# EAGLE design th12 (EAGLE 5.12)

## Sheet 1 of 2
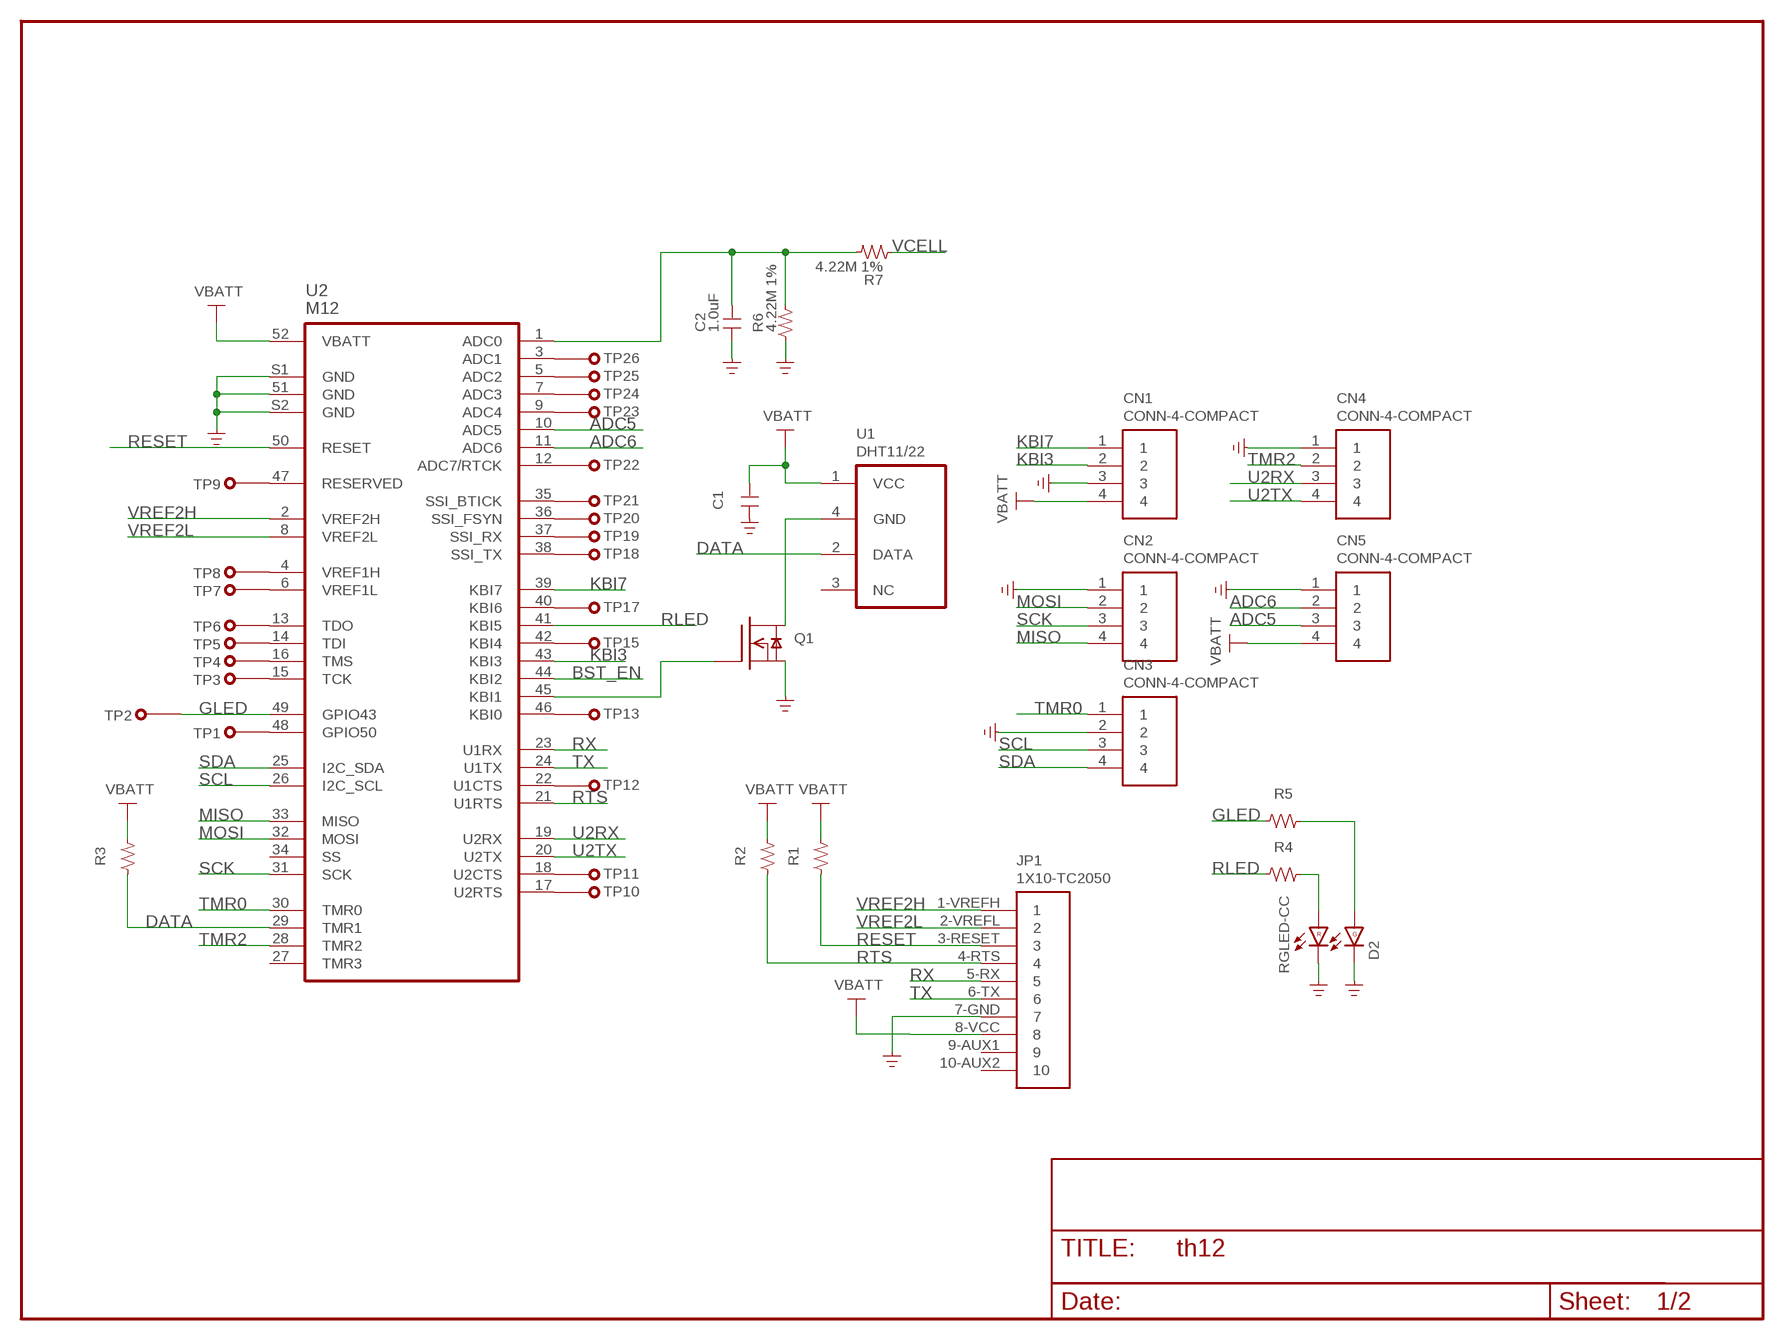
[diagram p0: schematic, sheet 1]

### Parts
C1  C-0603  [SMD0603]
C2  1.0uF  C-0603  [SMD0603]
CN1  CONN-4-COMPACT  [1X4-3.5MM-COMPACT]
CN2  CONN-4-COMPACT  [1X4-3.5MM-COMPACT]
CN3  CONN-4-COMPACT  [1X4-3.5MM-COMPACT]
CN4  CONN-4-COMPACT  [1X4-3.5MM-COMPACT]
CN5  CONN-4-COMPACT  [1X4-3.5MM-COMPACT]
D2  RGLED-CC  [598-8520-207F]
JP1  1X10-TC2050  [TC2050-IDC]
Q1  NFET  [SOT23-GSD]
R1  R-0603  [SMD0603]
R2  R-0603  [SMD0603]
R3  R-0603  [SMD0603]
R4  R-0603  [SMD0603]
R5  R-0603  [SMD0603]
R6  4.22M 1%  R-0603  [SMD0603]
R7  4.22M 1%  R-0603  [SMD0603]
TP1  TP  [15MIL]
TP2  TP  [15MIL]
TP3  TP  [15MIL]
TP4  TP  [15MIL]
TP5  TP  [15MIL]
TP6  TP  [15MIL]
TP7  TP  [15MIL]
TP8  TP  [15MIL]
TP9  TP  [15MIL]
TP10  TP  [15MIL]
TP11  TP  [15MIL]
TP12  TP  [15MIL]
TP13  TP  [15MIL]
TP15  TP  [15MIL]
TP17  TP  [15MIL]
TP18  TP  [15MIL]
TP19  TP  [15MIL]
TP20  TP  [15MIL]
TP21  TP  [15MIL]
TP22  TP  [15MIL]
TP23  TP  [15MIL]
TP24  TP  [15MIL]
TP25  TP  [15MIL]
TP26  TP  [15MIL]
U1  DHT11/22  [DHT22]
U2  M12  [M12]

### Nets
ADC5: CN5.3 U2.10(ADC5)
ADC6: CN5.2 U2.11(ADC6)
BST_EN: U2.44(KBI2) ; also sheet 2
DATA: R3.1 U1.2(DATA) U2.29(TMR1)
GLED: R5.1 TP2.1 U2.49(GPIO43)
GND: C1.1 C2.1 CN1.3 CN2.1 CN3.2 CN4.1 CN5.1 D2.2 D2.4 JP1.7-GND Q1.S R6.1 U2.51(GND) U2.S1(GND) U2.S2(GND) ; also sheet 2
KBI3: CN1.2 U2.43(KBI3)
KBI7: CN1.1 U2.39(KBI7)
MISO: CN2.4 U2.33(MISO)
MOSI: CN2.2 U2.32(MOSI)
N$1: Q1.D U1.4(GND)
N$2: Q1.G U2.45(KBI1)
N$3: TP1.1 U2.48(GPIO50)
N$5: TP3.1 U2.15(TCK)
N$6: TP4.1 U2.16(TMS)
N$7: TP5.1 U2.14(TDI)
N$8: TP6.1 U2.13(TDO)
N$9: TP7.1 U2.6(VREF1L)
N$10: TP8.1 U2.4(VREF1H)
N$11: TP9.1 U2.47(RESERVED)
N$12: TP10.1 U2.17(U2RTS)
N$13: TP11.1 U2.18(U2CTS)
N$14: TP12.1 U2.22(U1CTS)
N$15: TP13.1 U2.46(KBI0)
N$16: C2.2 R6.2 R7.2 U2.1(ADC0)
N$17: TP15.1 U2.42(KBI4)
N$19: TP17.1 U2.40(KBI6)
N$20: TP18.1 U2.38(SSI_TX)
N$21: TP19.1 U2.37(SSI_RX)
N$22: TP20.1 U2.36(SSI_FSYN)
N$23: TP21.1 U2.35(SSI_BTICK)
N$24: TP22.1 U2.12(ADC7/RTCK)
N$25: TP23.1 U2.9(ADC4)
N$26: TP24.1 U2.7(ADC3)
N$27: TP25.1 U2.5(ADC2)
N$28: TP26.1 U2.3(ADC1)
N$30: D2.1 R5.2
N$31: D2.3 R4.2
RESET: JP1.3-RESET R1.1 U2.50(RESET)
RLED: R4.1 U2.41(KBI5)
RTS: JP1.4-RTS R2.1 U2.21(U1RTS)
RX: JP1.5-RX U2.23(U1RX)
SCK: CN2.3 U2.31(SCK)
SCL: CN3.3 U2.26(I2C_SCL)
SDA: CN3.4 U2.25(I2C_SDA)
TMR0: CN3.1 U2.30(TMR0)
TMR2: CN4.2 U2.28(TMR2)
TX: JP1.6-TX U2.24(U1TX)
U2RX: CN4.3 U2.19(U2RX)
U2TX: CN4.4 U2.20(U2TX)
VBATT: C1.2 CN1.4 CN5.4 JP1.8-VCC R1.2 R2.2 R3.2 U1.1(VCC) U2.52(VBATT) ; also sheet 2
VCELL: R7.1 ; also sheet 2
VREF2H: JP1.1-VREFH U2.2(VREF2H)
VREF2L: JP1.2-VREFL U2.8(VREF2L)
Unconnected: JP1.9-AUX1 JP1.10-AUX2 U1.3(NC) U2.27(TMR3) U2.34(SS)

## Sheet 2 of 2
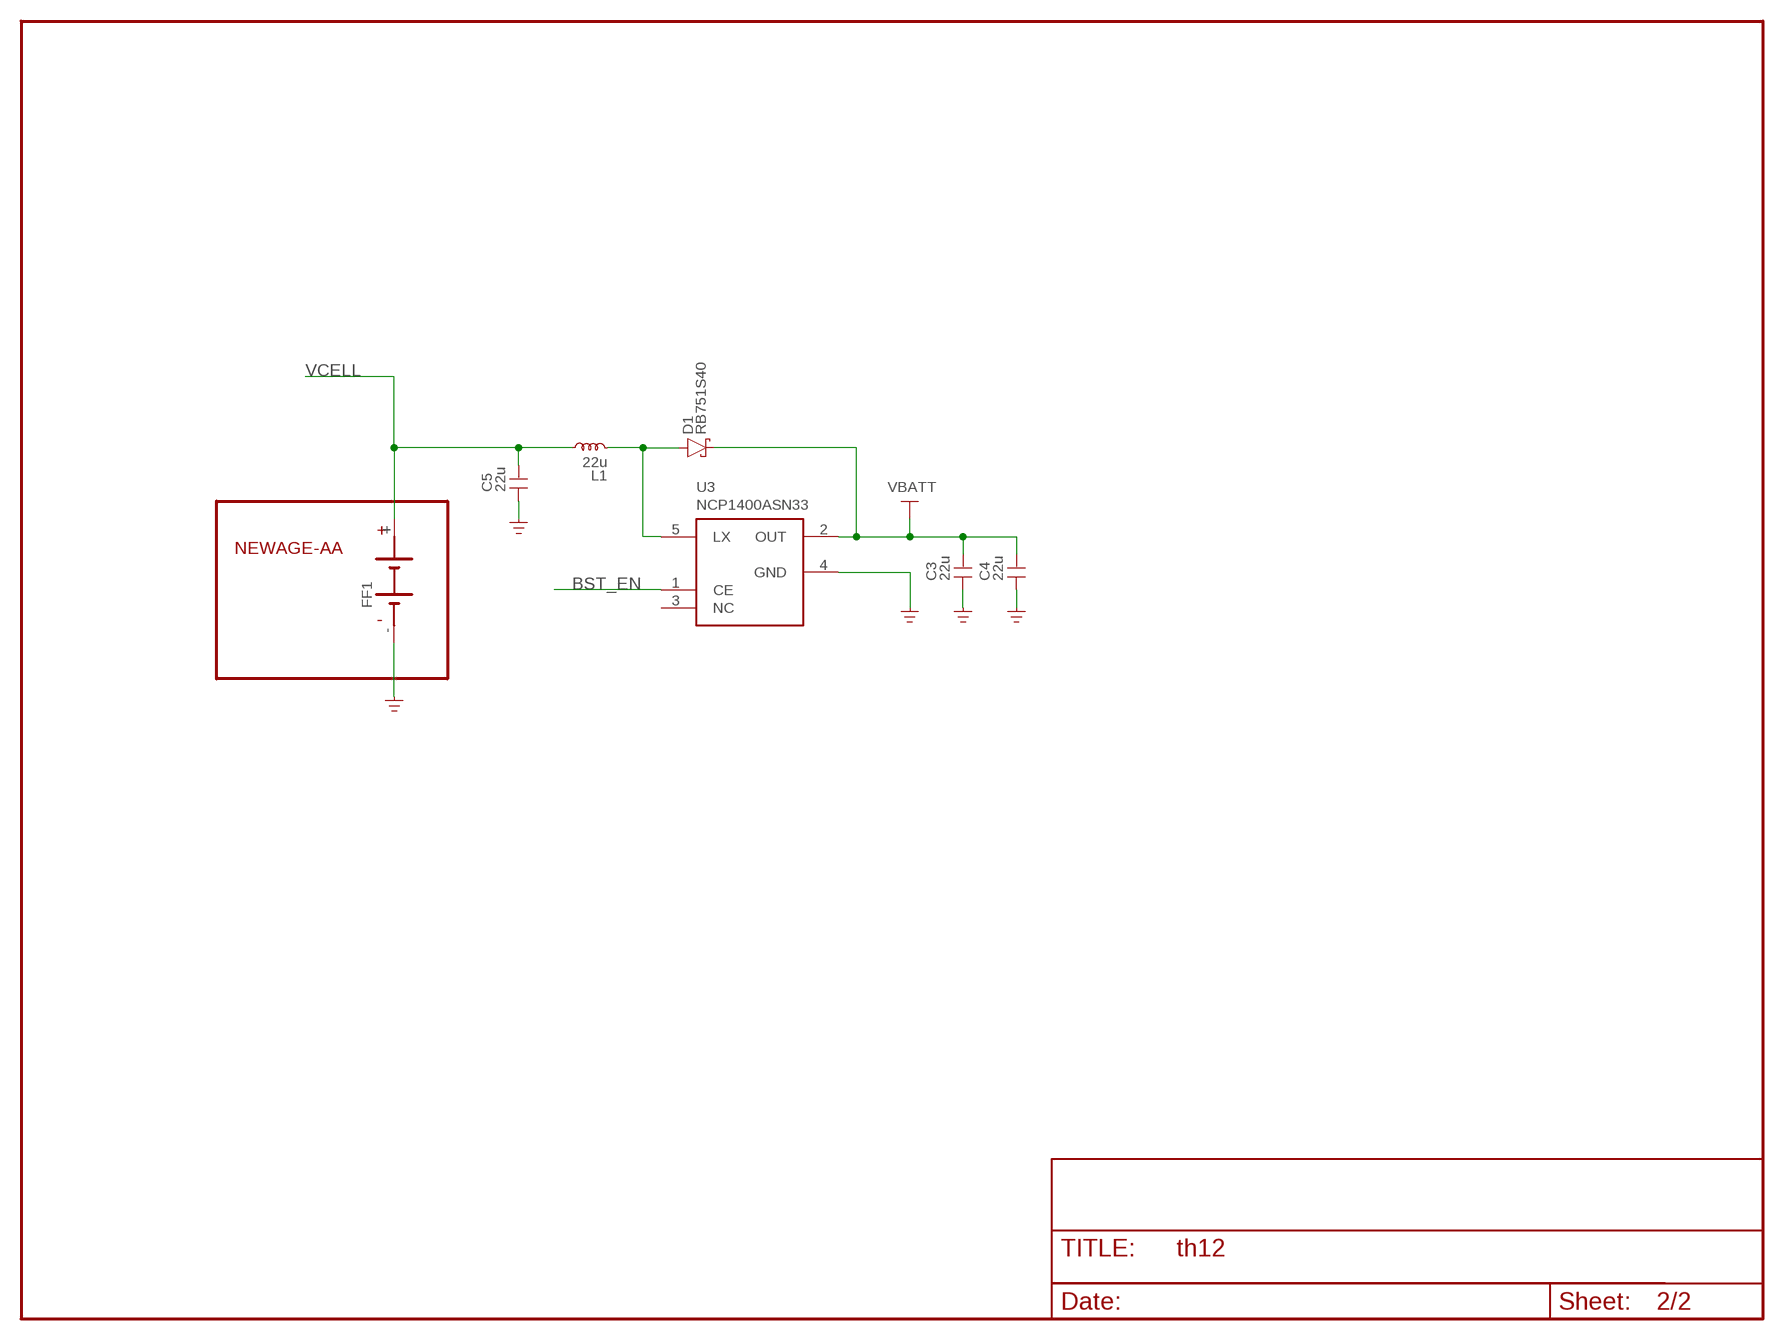
[diagram p1: schematic, sheet 2]

### Parts
C3  22u  C-0805  [SMD0805]
C4  22u  C-0805  [SMD0805]
C5  22u  C-0805  [SMD0805]
D1  RB751S40  D-SCHOTTKY-SOD523  [SOD-523]
FF1  NEWAGE-AA  [NEWAGE-AA-SIMPLE]
L1  22u  L-2518  [SMD2518]
U3  NCP1400ASN33  [SOT-23-5]

### Nets
BST_EN: U3.1(CE) ; also sheet 1
GND: C3.1 C4.1 C5.1 FF1.-(-1) U3.4(GND) ; also sheet 1
N$4: D1.A L1.2 U3.5(LX)
VBATT: C3.2 C4.2 D1.K(C) U3.2(OUT) ; also sheet 1
VCELL: C5.2 FF1.+(+1) L1.1 ; also sheet 1
Unconnected: U3.3(NC)

## Library data of the parts
C1-C5 = parts:C
CN1-CN5 = parts:CONN-4
D1 = parts:D-SCHOTTKY
D2 = parts:RGLED-CC
FF1 = parts:NEWAGE-AA
JP1 = parts:1X10
L1 = parts:L: TDK SLF6028 Series From mouser: 810-SLF6028T-101M, 100uH, .42A, $2.73 From digikey: 445-1990-1-ND, 100uH, .42A, $2.73
Q1 = parts:NFET
R1-R7 = parts:R
TP1-TP13 TP15 TP17-TP26 = parts:TP
U1 = parts:DHT11/22
U2 = parts:M12
U3 = parts:NCP1400ASN*

## Board
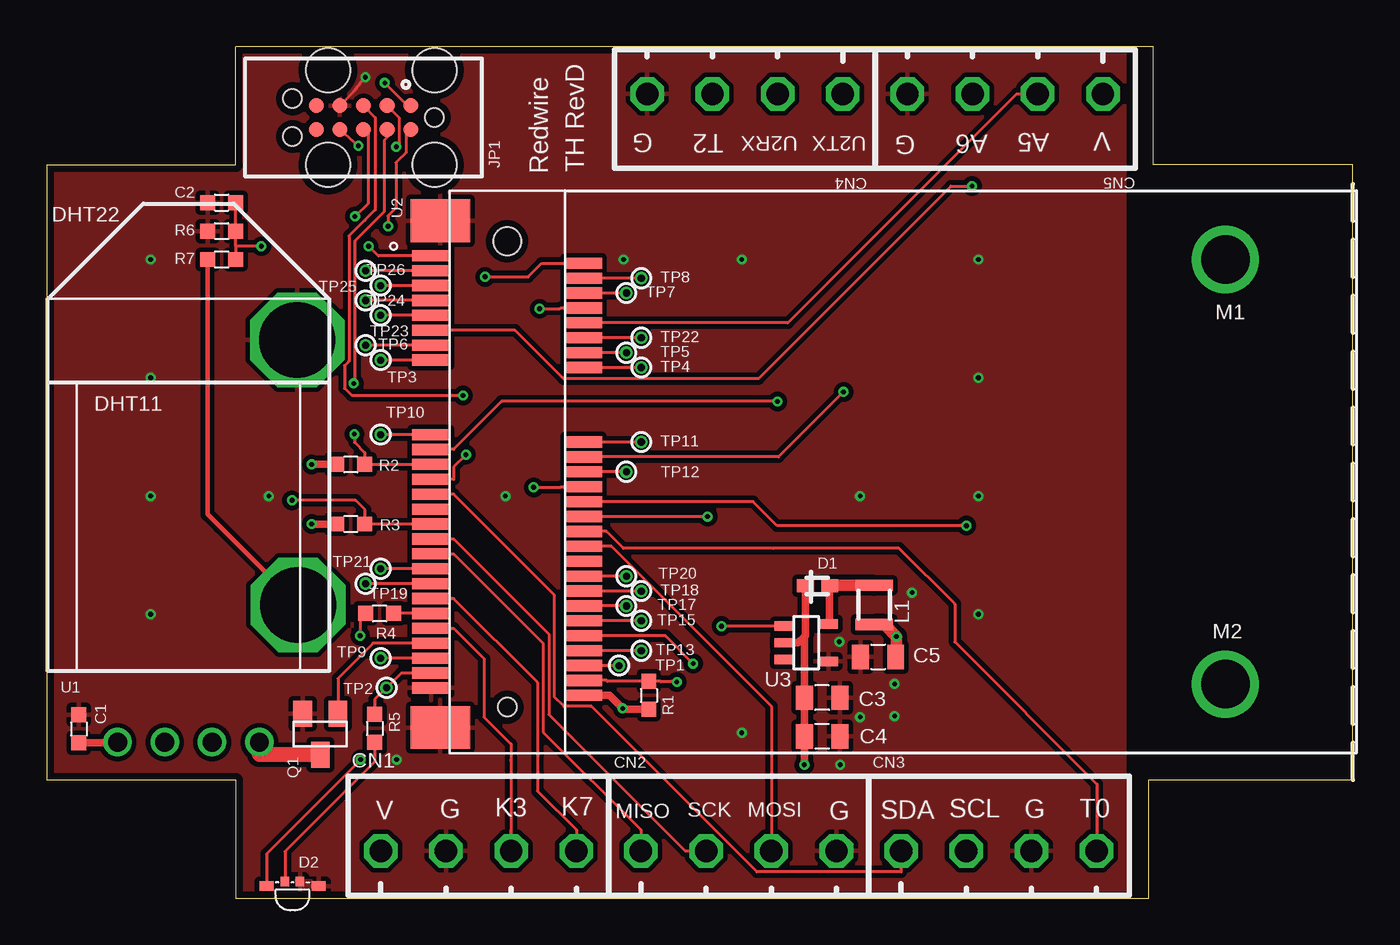
[diagram p2: board, top side]
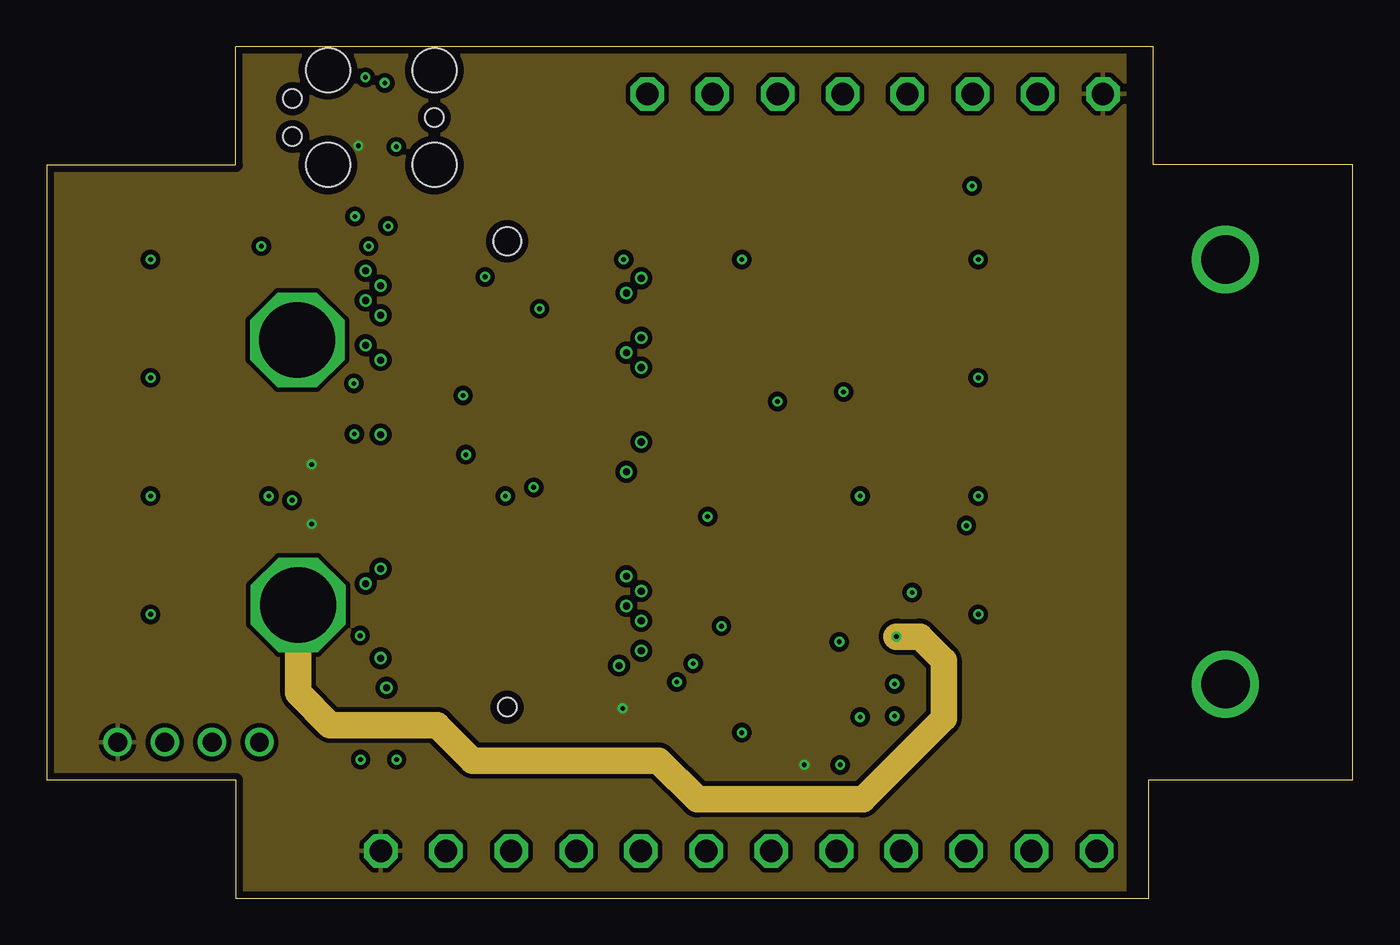
[diagram p3: board, inner layer Route2]
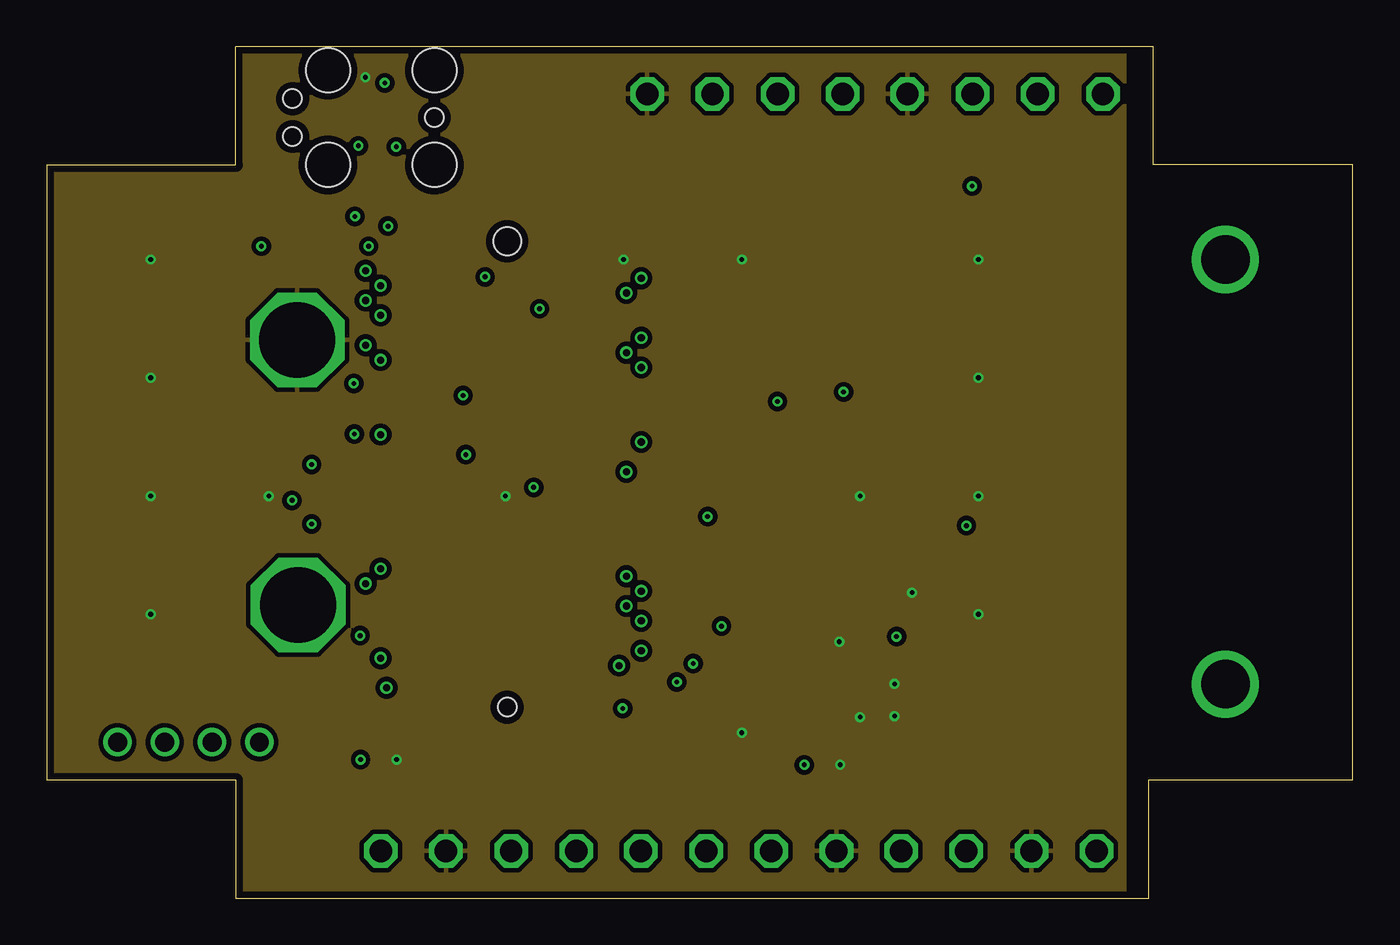
[diagram p4: board, inner layer Route3]
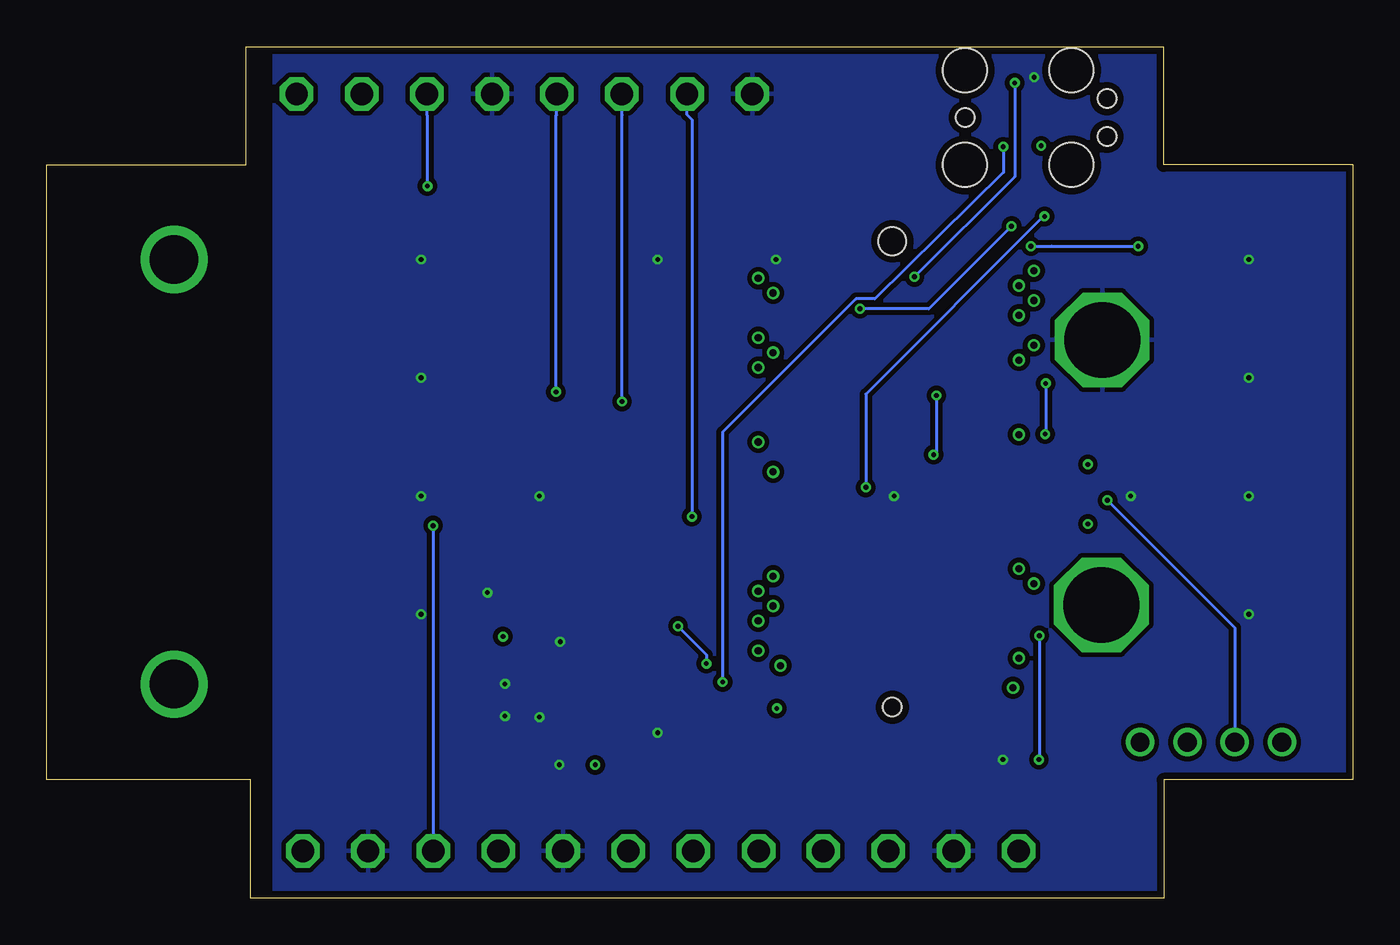
[diagram p5: board, bottom side, seen from below]

Size 70.15 x 45.72 mm. Coordinates in mm from the lower left corner, seen from the top.
Copper layers (1+2*3+16): Top 0.0356mm / dielectric 0.2794mm / Route2 0.0356mm / dielectric 0.9906mm / Route3 0.0356mm / dielectric 0.2794mm / Bottom 0.0356mm
Design rules "66each-compact *": minimum track width 6mil, minimum drill 10mil, track to track 6mil, track to pad 6mil, pad to pad 6mil, via to via 6mil, smd to smd 6mil, copper to edge 15mil, drill to drill 10mil, minimum pad ring 5.5mil, minimum via ring 5.5mil, stop-mask expansion 2.5mil, vias tented up to drill 15mil, thermal gap 10mil

### Footprints (pad centres in the part's own frame; a part is rotated, then mirrored left to right if it is on the bottom)
SMD0603 = smd 0.8 x 0.8: 1 -0.75,0; 2 0.75,0
SMD0805 = smd 0.9 x 1.3: 1 -0.95,0; 2 0.95,0
1X4-3.5MM-COMPACT = drill 1.2 octagon: 1 0,0; 2 0,-3.5; 3 0,-7; 4 0,-10.5
SOD-523 = smd 0.9 x 0.7: A -0.65,0; K 0.65,0
598-8520-207F = smd 0.5 x 0.5: 1 0.4,-0.55; 2 -0.4,-0.55 | smd 0.8 x 0.5: 3 1.4,-0.3; 4 -1.4,-0.3
NEWAGE-AA-SIMPLE = drill 4.064 octagon: + -21.285,-7.112; - -21.336,7.112
TC2050-IDC = smd 0.8 x 0.8: 1-VREFH -2.54,-0.635; 2-VREFL -2.54,0.635; 3-RESET -1.27,-0.635; 4-RTS -1.27,0.635; 5-RX 0,-0.635; 6-TX 0,0.635; 7-GND 1.27,-0.635; 8-VCC 1.27,0.635; 9-AUX1 2.54,-0.635; 10-AUX2 2.54,0.635 | hole 1: -3.81,0; 3.81,1.016; 3.81,-1.016 | hole 2.375: -3.81,2.54; -3.81,-2.54; 1.905,2.54; 1.905,-2.54
SMD2518 = smd 0.6 x 2: 1 -1.05,0; 2 1.05,0
SOT23-GSD = smd 1 x 1.4: D 0,1.1; G -0.95,-1.1; S 0.95,-1.1
15MIL = drill 0.381 round: 1 0,0
DHT22 = drill 1.016 round: 1 -3.81,-3.81; 2 -1.27,-3.81; 3 1.27,-3.81; 4 3.81,-3.81
M12 = smd 0.6 x 2: 1 -11.6,-4.1; 2 -11.2,4.1; 3 -10.8,-4.1; 4 -10.4,4.1; 5 -10,-4.1; 6 -9.6,4.1; 7 -9.2,-4.1; 8 -8.8,4.1; 9 -8.4,-4.1; 10 -8,4.1; 11 -7.6,-4.1; 12 -7.2,4.1; 13 -6.8,-4.1; 14 -6.4,4.1; 15 -6,-4.1; 16 -5.6,4.1; 17 -2,-4.1; 18 -1.6,4.1; 19 -1.2,-4.1; 20 -0.8,4.1; 21 -0.4,-4.1; 22 0,4.1; 23 0.4,-4.1; 24 0.8,4.1; 25 1.2,-4.1; 26 1.6,4.1; 27 2,-4.1; 28 2.4,4.1; 29 2.8,-4.1; 30 3.2,4.1; 31 3.6,-4.1; 32 4,4.1; 33 4.4,-4.1; 34 4.8,4.1; 35 5.2,-4.1; 36 5.6,4.1; 37 6,-4.1; 38 6.4,4.1; 39 6.8,-4.1; 40 7.2,4.1; 41 7.6,-4.1; 42 8,4.1; 43 8.4,-4.1; 44 8.8,4.1; 45 9.2,-4.1; 46 9.6,4.1; 47 10,-4.1; 48 10.4,4.1; 49 10.8,-4.1; 50 11.2,4.1; 51 11.6,-4.1; 52 12,4.1 | drill 2.6 round: 53 -11.4,38.565; 54 11.4,38.565 | smd 2.3 x 3.2: S1 -13.473,-3.6; S2 13.727,-3.6 | hole 1.016: 12.627,0 | hole 1.499: -12.373,0
SOT-23-5 = smd 0.5 x 1: 1 0.9,1.3; 2 0,1.3; 3 -0.9,1.3; 4 -1,-1.1; 5 1,-1.1

### Placement (x,y rotation side)
C1  1.74,9.09 270 top
C2  9.4,37.34 0 top
C3  41.66,10.77 180 top
C4  41.66,8.69 180 top
C5  44.65,12.95 0 top
CN1  28.45,2.54 270 top
CN2  42.42,2.54 270 top
CN3  56.39,2.54 270 top
CN4  32.26,43.18 90 top
CN5  46.23,43.18 90 top
D1  41.4,16.76 180 top
D2  13.21,0.36 180 top
FF1  34.8,22.86 0 top
JP1  17.02,41.91 180 top
L1  44.45,15.75 90 top
Q1  14.7,8.81 180 top
R1  32.34,10.89 270 top
R2  16.34,23.29 180 top
R3  16.34,20.09 180 top
R4  17.88,15.29 180 top
R5  17.63,9.12 270 top
R6  9.4,35.81 0 top
R7  9.4,34.29 0 top
TP1  30.74,12.49 0 top
TP2  18.26,11.3 0 top
TP3  17.94,28.89 0 top
TP4  31.94,28.49 0 top
TP5  31.14,29.29 0 top
TP6  17.14,29.69 0 top
TP7  31.14,32.49 0 top
TP8  31.94,33.29 0 top
TP9  17.94,12.89 0 top
TP10  17.94,24.89 0 top
TP11  31.94,24.49 0 top
TP12  31.14,22.89 0 top
TP13  31.94,13.29 0 top
TP15  31.94,14.89 0 top
TP17  31.14,15.69 0 top
TP18  31.94,16.49 0 top
TP19  17.14,16.89 0 top
TP20  31.14,17.29 0 top
TP21  17.94,17.69 0 top
TP22  31.94,30.09 0 top
TP23  17.94,31.29 0 top
TP24  17.14,32.09 0 top
TP25  17.94,32.89 0 top
TP26  17.14,33.69 0 top
U1  7.62,12.19 0 top
U2  24.74,22.89 270 top
U3  40.89,13.72 90 top

### Tracks (layer width: path | path; a pad name or v marks a point on that pad's centre or on a via)
ADC5
  Top 0.152: U2.10 39.81,30.89 52.1,43.18 CN5.3
ADC6  (via drill 0.25 pad 0.51)
  Top 0.152: U2.11 25.16,30.49 27.76,27.89 38.22,27.89 48.55,38.23 v49.7,38.23
  Bottom 0.152: v49.7,38.23 49.7,42.02 49.73,42.05 CN5.2
BST_EN  (via drill 0.25)
  Top 0.152: U2.44 33.23,14.09 v34.72,12.6 | v36.25,14.6 39.58,14.6 U3.1
  Bottom 0.152: v34.72,12.6 34.72,13.08 v36.25,14.6
DATA  (via drill 0.25)
  Top 0.152: U2.29 R3.1 17.09,20.85 16.59,21.36 v13.18,21.36
  Bottom 0.152: U1.2 6.35,14.53 v13.18,21.36
GLED
  Top 0.152: U2.49 19.04,12.09 TP2.1 17.63,10.67 R5.1
GND  (via drill 0.25 pad 0.51)
  Top 0.152: JP1.7-GND 16.49,43.28 v17.12,44.07
  other vias: 50.04,21.59 50.04,27.94 50.04,15.24 43.69,21.59 50.04,34.29 5.59,21.59 5.59,15.24 5.59,27.94 5.59,34.29 11.94,21.59 24.64,21.59 30.99,34.29 37.34,34.29 37.34,8.89 18.8,7.44 42.57,13.77 43.69,9.73 42.62,7.16 45.54,11.51 45.54,9.78 46.48,16.41
  pour Top (isolate 0.254): 0,6.35 10.16,6.35 10.16,0 57.91,0 57.91,45.72 10.16,45.72 10.16,39.37 0,39.37
  pour Bottom (isolate 0.254): 0,6.35 10.16,6.35 10.16,0 57.91,0 57.91,45.72 10.16,45.72 10.16,39.37 0,39.37
  pour Route3 (isolate 0.254): 0,6.35 10.16,6.35 10.16,0 57.91,0 57.91,45.72 10.16,45.72 10.16,39.37 0,39.37
KBI3
  Top 0.152: U2.43 21.87,14.49 23.5,12.86 23.5,9.73 24.95,8.27 24.95,7.37 | 24.95,3.45 24.95,3.67 | 24.95,3.45 CN1.2 | 24.95,7.37 24.95,7.47 | 24.95,7.37 24.95,3.45
KBI7
  Top 0.152: CN1.1 28.45,3.67 26.36,5.75 26.36,11.59 21.87,16.09 U2.39
MISO
  Top 0.152: U2.33 21.87,18.49 26.67,13.69 26.67,8.92 31.92,3.67 CN2.4
MOSI
  Top 0.152: U2.32 30.34,18.89 38.92,10.31 CN2.2
N$1
  Top 0.813: Q1.D 11.43,7.71 U1.4
N$2
  Top 0.152: U2.45 17.54,13.69 15.65,11.8 Q1.G
N$3
  Top 0.152: TP1.1 U2.48
N$4
  Top 0.406: U3.5 42.05,14.77 D1.A
  Top 0.61: L1.2 42.09,16.8 D1.A
N$5
  Top 0.152: U2.15 TP3.1
N$6
  Top 0.152: TP4.1 U2.16
N$7
  Top 0.152: TP5.1 U2.14
N$8
  Top 0.152: U2.13 TP6.1
N$9
  Top 0.152: TP7.1 U2.6
N$10
  Top 0.152: TP8.1 U2.4
N$11
  Top 0.152: U2.47 TP9.1
N$12
  Top 0.152: U2.17 TP10.1
N$13
  Top 0.152: TP11.1 U2.18
N$14
  Top 0.152: TP12.1 U2.22
N$15
  Top 0.152: TP13.1 U2.46
N$16  (via drill 0.25)
  Top 0.152: U2.1 17.81,34.49 v17.3,35 | 10.15,35.03 R6.2 C2.2 | 10.15,35.03 R7.2 | v11.53,35 10.17,35 10.15,35.03
  Bottom 0.152: v17.3,35 16.18,35 v11.53,35
N$17
  Top 0.152: TP15.1 U2.42
N$19
  Top 0.152: TP17.1 U2.40
N$20
  Top 0.152: TP18.1 U2.38
N$21
  Top 0.152: U2.37 TP19.1
N$22
  Top 0.152: TP20.1 U2.36
N$23
  Top 0.152: U2.35 TP21.1
N$24
  Top 0.152: TP22.1 U2.12
N$25
  Top 0.152: U2.9 TP23.1
N$26
  Top 0.152: U2.7 TP24.1
N$27
  Top 0.152: U2.5 TP25.1
N$28
  Top 0.152: U2.3 TP26.1
N$30
  Top 0.152: R5.2 17.63,7.34 12.81,2.52 D2.1 12.65,0.94
N$31  (via drill 0.25)
  Top 0.152: R4.2 16.84,15 v16.84,14.1 | v16.87,7.44 11.81,2.38 D2.3
  Bottom 0.152: v16.84,14.1 16.84,7.44 v16.87,7.44
RESET  (via drill 0.25 pad 0.51)
  Top 0.152: U2.50 30.07,11.69 30.12,11.64 R1.1 32.97,11.64 33,11.61 v33.85,11.61 | v18.78,40.34 18.92,40.34 18.92,41.91 JP1.3-RESET
  Bottom 0.152: v33.85,11.61 33.85,25.02 26.69,32.18 25.68,32.18 18.77,38.96 18.77,40.22 18.77,40.34 v18.78,40.34
RLED
  Top 0.152: U2.41 R4.1
RTS  (via drill 0.25 pad 0.51)
  Top 0.152: v16.5,27.63 16.55,27.69 16.55,35.28 18.14,36.86 18.14,40.69 18.29,40.84 JP1.4-RTS | U2.21 R2.1 17.09,23.92 16.53,24.48 v16.53,24.92
  Bottom 0.152: v16.5,27.63 16.5,24.95 v16.53,24.92
RX  (via drill 0.25 pad 0.51)
  Top 0.152: v22.37,26.99 16.39,26.99 16,27.38 16,28.6 16.24,28.84 16.24,35.56 17.08,36.39 17.09,36.39 17.65,36.96 17.65,41.91 JP1.5-RX | v22.52,23.81 21.87,23.16 21.87,22.49 U2.23
  Bottom 0.152: v22.37,26.99 22.37,23.97 v22.52,23.81
SCK
  Top 0.152: U2.31 21.87,19.29 26.97,14.18 26.97,9.85 34.29,2.54 CN2.3
SCL  (via drill 0.25 pad 0.51)
  Top 0.152: U2.26 37.95,21.29 39.24,20 v49.4,20
  Bottom 0.152: v49.4,20 49.4,3.68 49.39,3.67 CN3.3
SDA
  Top 0.152: CN3.4 45.89,1.41 38.14,1.41 29.26,10.3 27.78,10.3 27.28,10.8 27.28,16.28 21.87,21.69 U2.25
TMR0
  Top 0.152: U2.30 30.07,19.69 30.97,18.78 39.02,18.78 45.78,18.78 48.77,15.8 48.77,13.77 56.41,6.12 56.41,2.56 CN3.1
TMR2  (via drill 0.25 pad 0.51)
  Top 0.152: v35.5,20.49 U2.28
  Bottom 0.152: v35.5,20.49 35.5,41.79 35.76,42.05 CN4.2
TX  (via drill 0.25 pad 0.51)
  Top 0.152: U2.24 27.61,22.09 27.58,22.06 v26.16,22.06 | JP1.6-TX 17.27,41.02 17.27,37.28 v16.56,36.6
  Bottom 0.152: v16.56,36.6 16.64,36.58 26.16,27.07 v26.16,22.06
U2RX  (via drill 0.25 pad 0.51)
  Top 0.152: v39.25,26.67 24.44,26.67 21.87,24.09 U2.19
  Bottom 0.152: CN4.3 39.26,42.05 39.25,42.04 v39.25,26.67
U2TX  (via drill 0.25 pad 0.51)
  Top 0.152: U2.20 39.31,23.69 v42.8,27.18
  Bottom 0.152: CN4.4 42.76,42.05 42.8,42.01 v42.8,27.18
VBATT  (via drill 0.25, 0.25 pad 0.51)
  Top 0.152: v16.75,40.39 16.75,40.41 JP1.8-VCC | C3.2 40.71,12.05
  Top 0.406: R3.2 v14.24,20.09 | R2.2 v14.24,23.29 | U2.52 30.24,10.89 v30.94,10.19 30.99,10.14 R1.2 | U1.1 3.77,8.34 C1.2 | U3.2 40.36,13.72 40.69,14.05 | 40.69,14.05 40.74,14.1 D1.K | 40.69,14.05 40.71,14.03 C3.2 C4.2 40.71,7.2 v40.69,7.16
  pour Route2 (isolate 0.254): 0,6.35 10.16,6.35 10.16,0 57.91,0 57.91,45.72 10.16,45.72 10.16,39.37 0,39.37
VCELL  (via drill 0.25)
  Top 0.254: FF1.+ 9.3,19.96 8.65,20.61 8.65,32.42 R7.1
  Top 0.61: L1.1 44.92,14.7 44.99,14.7 v45.64,14.05 45.64,12.99 C5.2
  Route2 1.422: FF1.+ 13.51,11.02 15.24,9.3 20.98,9.3 22.89,7.39 32.87,7.39 34.95,5.31 43.84,5.31 48.18,9.65 48.18,12.75 46.89,14.05 v45.64,14.05
VREF2H  (via drill 0.25 pad 0.51)
  Top 0.152: v23.55,33.36 25.87,33.36 26.59,34.09 U2.2 | JP1.1-VREFH 19.38,42.55 v18.16,43.77
  Bottom 0.152: v18.16,43.77 18.16,38.74 v23.55,33.36
VREF2L  (via drill 0.25 pad 0.51)
  Top 0.152: v18.34,36.08 18.34,36.64 18.77,37.07 18.77,39.5 19.3,40.03 19.3,41.27 JP1.2-VREFL | v26.47,31.64 27.56,31.64 27.61,31.69 U2.8
  Bottom 0.152: v26.47,31.64 22.77,31.64 v18.34,36.08

### Text on the board
tPlace: G | T2 | U2RX | U2TX | G | A6 | A5 | V | Redwire | TH RevD | M1 | M2 | V | G | K3 | K7 | MISO | SCK | MOSI | G | SDA | SCL | G | T0